# Altium schematic sheet CPU - Communications.SchDoc: Title
size Tabloid; Revision: A; ProjectTitle: CDU: CAN Display Unit
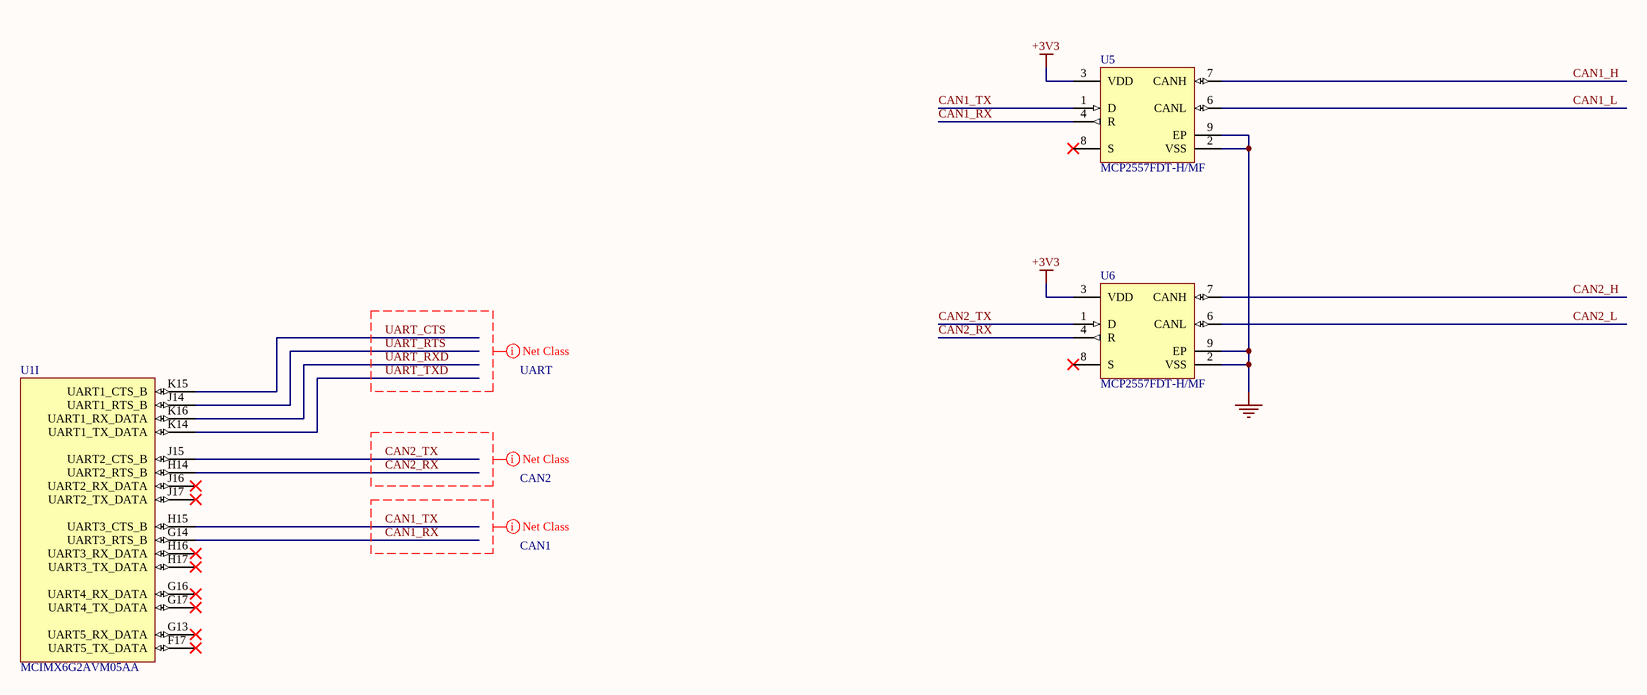
[diagram p0: CPU - Communications.SchDoc]

## Parts
U1  MCIMX6G2AVM05AA  [BGA289C80P17X17_1400X1400X132]  (part I of 14)
U5  MCP2557FDT-H/MF  [QFN65P300X300X90_HS-9N]
U6  MCP2557FDT-H/MF  [QFN65P300X300X90_HS-9N]

## Nets
+3V3: U5.3(VDD) U6.3(VDD)
GND: U5.2(VSS) U5.9(EP) U6.2(VSS) U6.9(EP)
CAN1_H: U5.7(CANH)
CAN1_L: U5.6(CANL)
CAN1_RX: U1.G14(UART3_RTS_B) U5.4(R)
CAN1_TX: U1.H15(UART3_CTS_B) U5.1(D)
CAN2_H: U6.7(CANH)
CAN2_L: U6.6(CANL)
CAN2_RX: U1.H14(UART2_RTS_B) U6.4(R)
CAN2_TX: U1.J15(UART2_CTS_B) U6.1(D)
UART_CTS: U1.K15(UART1_CTS_B)
UART_RTS: U1.J14(UART1_RTS_B)
UART_RXD: U1.K16(UART1_RX_DATA)
UART_TXD: U1.K14(UART1_TX_DATA)

Not connected (* = marked no-connect by the designer): U1 F17(UART5_TX_DATA)* G13(UART5_RX_DATA)* G16(UART4_RX_DATA)* G17(UART4_TX_DATA)* H16(UART3_RX_DATA)* H17(UART3_TX_DATA)* J16(UART2_RX_DATA)* J17(UART2_TX_DATA)*; U5 5(NC) 8(S)*; U6 5(NC) 8(S)*

## Layout directives
net class CAN2: CAN2_RX, CAN2_TX
net class CAN1: CAN1_RX, CAN1_TX
net class UART: UART_CTS, UART_RTS, UART_RXD, UART_TXD

## Notes on the sheet
- Date:
- Revision:
- Sheet:
- /

## Library data of the parts
U5 U6 = MCP2557FDT-H/MF: CAN transceiver; Supplier 1: Digi-Key; Supplier Part Number 1: MCP2557FDT-H/MFCT-ND